# EAGLE design Tasmodul_WLED (EAGLE 9.6.2)
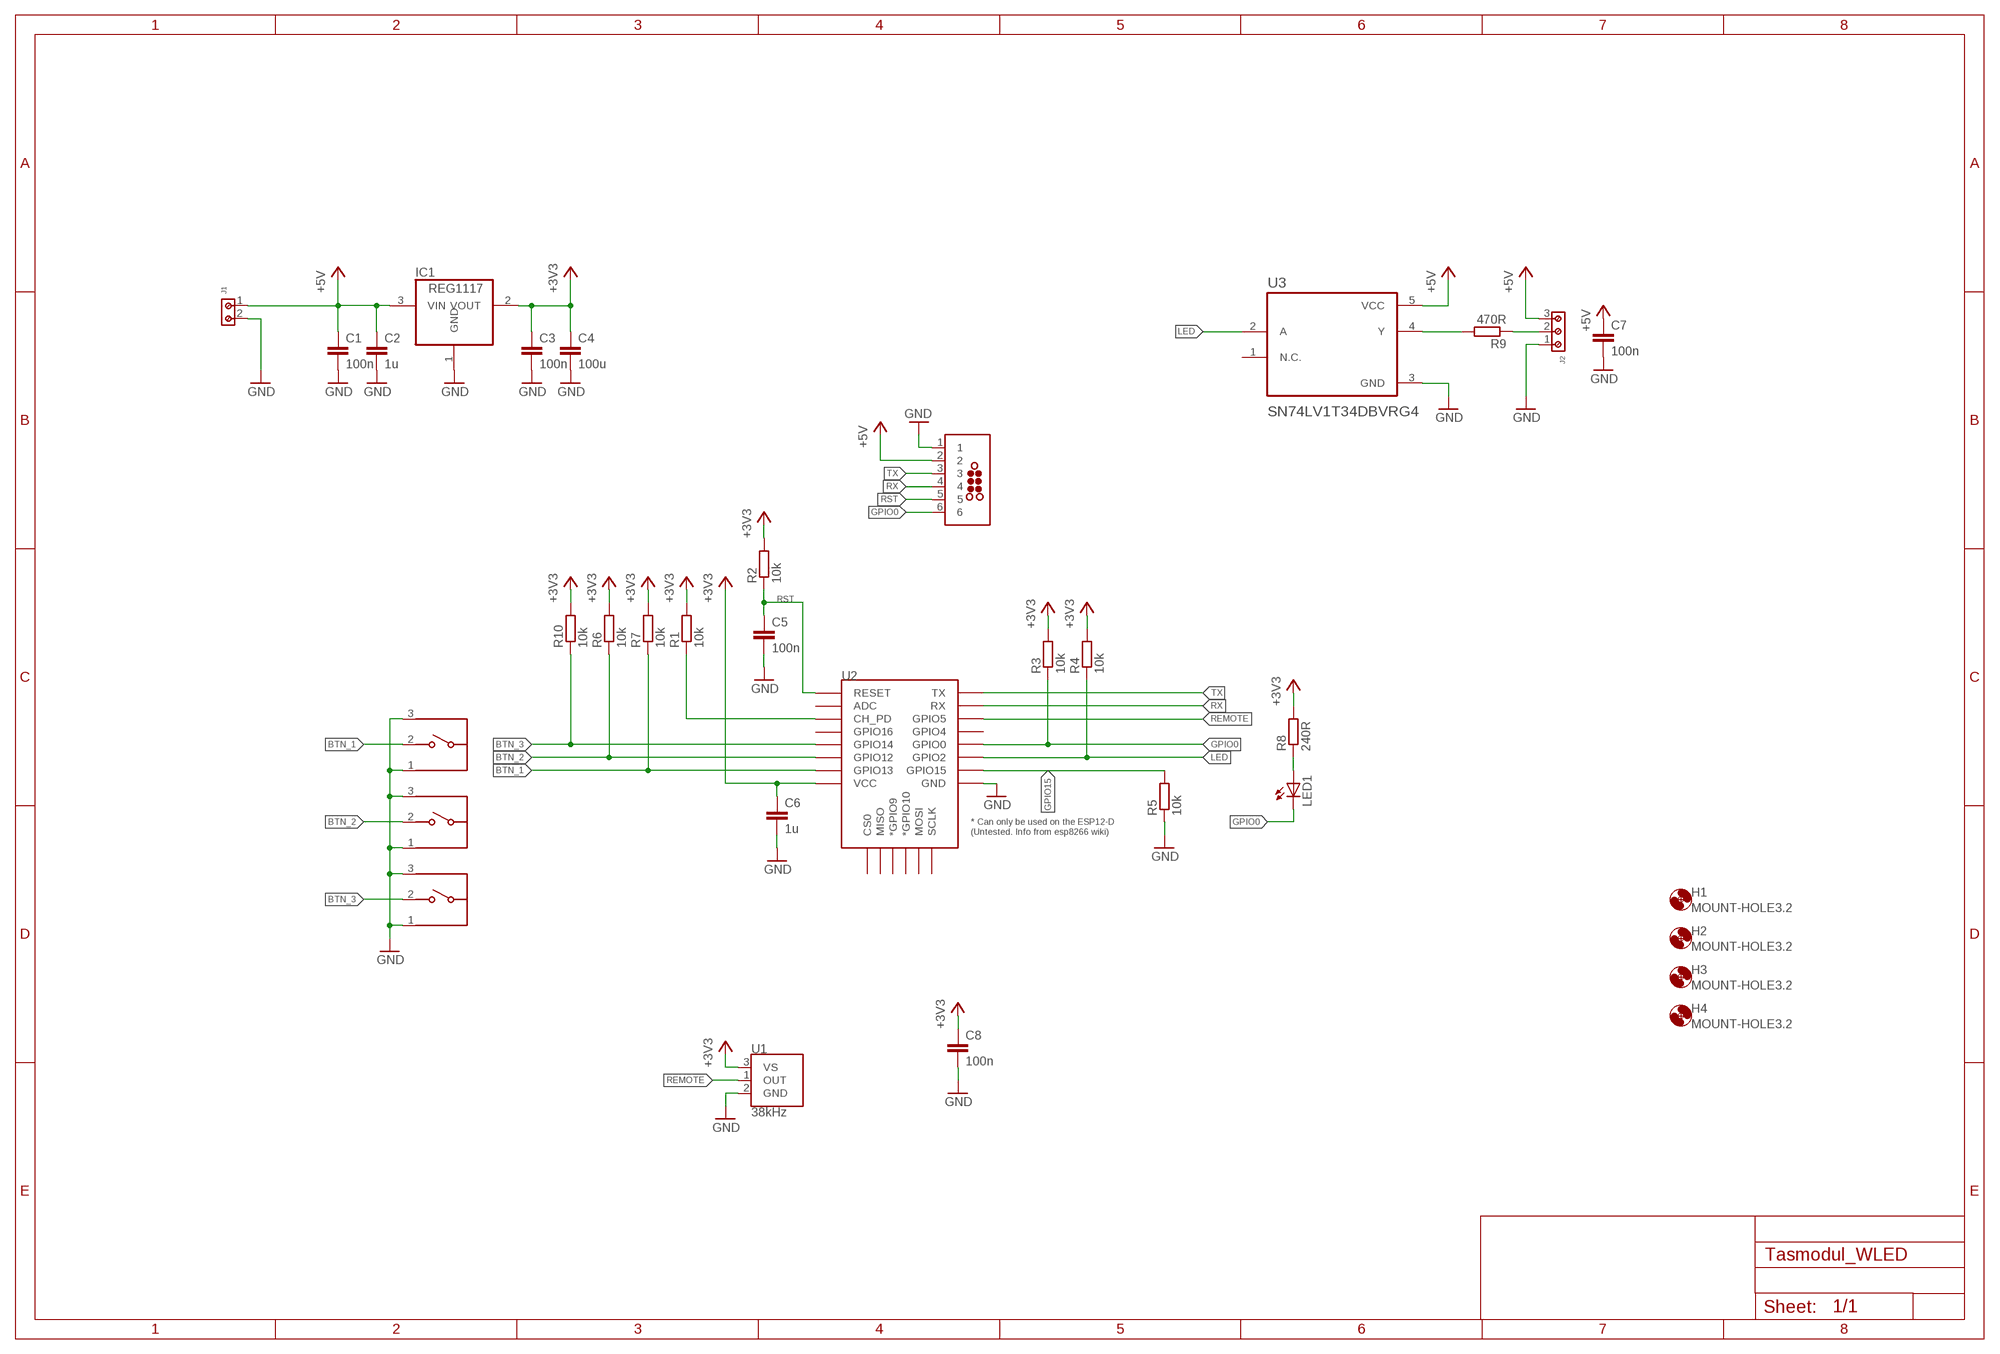
[diagram p0: schematic, sheet 1]

## Parts
C1  100n  C-EUC0603  [C0603]
C2  1u  C-EUC0603  [C0603]
C3  100n  C-EUC0603  [C0603]
C4  100u  C-EUC0603  [C0603]
C5  100n  C-EUC0603  [C0603]
C6  1u  C-EUC0603  [C0603]
C7  100n  C-EUC0603  [C0603]
C8  100n  C-EUC0603  [C0603]
H1  MOUNT-HOLE3.2  [3,2]
H2  MOUNT-HOLE3.2  [3,2]
H3  MOUNT-HOLE3.2  [3,2]
H4  MOUNT-HOLE3.2  [3,2]
IC1  REG1117  [SOT223]
J1  691210910002  [691210910002]
J2  691210910003  [691210910003]
J6  TC2030-MCP-NL  [TC2030-MCP-NL]
LED1  LEDCHIP-LED0603  [CHIP-LED0603]
R1  10k  R-EU_R0603  [R0603]
R2  10k  R-EU_R0603  [R0603]
R3  10k  R-EU_R0603  [R0603]
R4  10k  R-EU_R0603  [R0603]
R5  10k  R-EU_R0603  [R0603]
R6  10k  R-EU_R0603  [R0603]
R7  10k  R-EU_R0603  [R0603]
R8  240R  R-EU_R0603  [R0603]
R9  470R  R-EU_R0603  [R0603]
R10  10k  R-EU_R0603  [R0603]
S1  436333033816  [436333033816]
S2  436333033816  [436333033816]
S3  436333033816  [436333033816]
U1  38kHz  TSOP38238  [TSOP382]
U2  ESP12ESMD  [ESP12E-SMD]
U3  SN74LV1T34DBVRG4  [SOT95P280X145-5N]

## Nets
+3V3: C3.1 C4.1 C6.1 C8.1 IC1.2(VOUT) R1.2 R2.2 R3.2 R4.2 R6.2 R7.2 R8.2 R10.2 U1.3(VS) U2.VCC
+5V: C1.1 C2.1 C7.1 IC1.3(VIN) J1.1 J2.3 J6.2 U3.5(VCC)
BTN_1: R7.1 S3.2 U2.GPIO13
BTN_2: R6.1 S2.2 U2.GPIO12
BTN_3: R10.1 S1.2 U2.GPIO14
GND: C1.2 C2.2 C3.2 C4.2 C5.2 C6.2 C7.2 C8.2 IC1.1(GND) J1.2 J2.1 J6.1 R5.1 S1.1 S1.3 S2.1 S2.3 S3.1 S3.3 U1.2(GND) U2.GND U3.3(GND)
GPIO0: J6.6 LED1.C R3.1 U2.GPIO0
GPIO15: R5.2 U2.GPIO15
LED: R4.1 U2.GPIO2 U3.2(A)
N$1: LED1.A R8.1
N$2: R9.2 U3.4(Y)
N$3: J2.2 R9.1
N$5: R1.1 U2.CH_PD
REMOTE: U1.1(OUT) U2.GPIO5
RST: C5.1 J6.5 R2.1 U2.RESET
RX: J6.4 U2.RXD0(RX)
TX: J6.3 U2.TXD0(TX)
Unconnected: U2.ADC U2.CS0 U2.GPIO4 U2.GPIO9(*GPIO9) U2.GPIO10(*GPIO10) U2.GPIO16 U2.MISO U2.MOSI U2.SCLK U3.1(N.C.)

## Library data of the parts
C1-C8 = rcl:C-EU: CAPACITOR, European symbol
H1-H4 = holes:MOUNT-HOLE: MOUNTING HOLE with drill center marker
IC1 = burr-brown:REG1117: 800mA and 1A Low Dropout (LDO) Positive Regulator 1.8V, 2.5V, 2.85V, 3.3V, 5V, and Adj; MPN: REG1117; OC_FARNELL: 1097566; OC_NEWARK: 14P6981
J1 = Eagle_WR-TBL Rising Cage Clamp (rev20a):691210910002: WR-TBL Serie 2109 - 2.54 mm Horiz. Entry KIND PROPERTIES Pitch 2.54 mm MATERIAL PROPERTIES Insulator Material PA66 Insulator Flammability Rating UL94 V-0 Insulator Color Green Contact Material Brass Contact Plating Copper over Zinc Terminal Screw Material Steel Terminal Screw Plating Zinc Wire Guard Material Brass GENERAL INFORMATION Operating Temperature -40 up to +105 °C Compliance Lead free / RoHS ELECTRICAL PROPERTIES IR cULus 6 A Working Voltage [cULus] 150 V (AC) Withstanding Voltage [cULus] 1300 V (AC) Contact Resistance [cULus] 20 mΩ MECHANICAL PROPERTIES Wire Strip Length 4 up to 5 (mm) Screw M1.6 Solid Wire Section (AWG) 30 to 18 (AWG) Solid Wire Section (Metric) 0.0509 to 0.823 (mm²) Stranded Wire Section (AWG) 30 to 18 (AWG) Stranded Wire Section (Metric) 0.0509 to 0.823 (mm²) CERTIFICATION cULus Approval E315414 PACKAGING PROPERTIES Packaging Box <https://katalog.we-online.com/media/images/v2/o33231v209%20Family_WR-TBL_69121091000x.jpg> Details see: https://katalog.we-online.com/en/em/TBL_2_54_2109_HORIZONTAL_ENTRY_69121091000X Updated by Ella Wu 2019-11-12 2019(C) Wurth Elektronik; DATASHEET-URL: https://www.we-online.com/catalog/datasheet/691210910002.pdf; IR-UL: 6A; MOUNT: THT; PART-NUMBER: 691210910002; PINS: 2; PITCH: 2.54mm; TYPE: Horizontal; WIRE: 30 to 18 (AWG) 0.0509 to 0.823 (mm²); WORKING-VOLTAGE-UL: 150V (AC)
J2 = Eagle_WR-TBL Rising Cage Clamp (rev20a):691210910003: WR-TBL Serie 2109 - 2.54 mm Horiz. Entry KIND PROPERTIES Pitch 2.54 mm MATERIAL PROPERTIES Insulator Material PA66 Insulator Flammability Rating UL94 V-0 Insulator Color Green Contact Material Brass Contact Plating Copper over Zinc Terminal Screw Material Steel Terminal Screw Plating Zinc Wire Guard Material Brass GENERAL INFORMATION Operating Temperature -40 up to +105 °C Compliance Lead free / RoHS ELECTRICAL PROPERTIES IR cULus 6 A Working Voltage [cULus] 150 V (AC) Withstanding Voltage [cULus] 1300 V (AC) Contact Resistance [cULus] 20 mΩ MECHANICAL PROPERTIES Wire Strip Length 4 up to 5 (mm) Screw M1.6 Solid Wire Section (AWG) 30 to 18 (AWG) Solid Wire Section (Metric) 0.0509 to 0.823 (mm²) Stranded Wire Section (AWG) 30 to 18 (AWG) Stranded Wire Section (Metric) 0.0509 to 0.823 (mm²) CERTIFICATION cULus Approval E315414 PACKAGING PROPERTIES Packaging Box <https://katalog.we-online.com/media/images/v2/o33231v209%20Family_WR-TBL_69121091000x.jpg> Details see: https://katalog.we-online.com/en/em/TBL_2_54_2109_HORIZONTAL_ENTRY_69121091000X Updated by Ella Wu 2019-11-12 2019(C) Wurth Elektronik; DATASHEET-URL: https://www.we-online.com/catalog/datasheet/691210910003.pdf; IR-UL: 6A; MOUNT: THT; PART-NUMBER: 691210910003; PINS: 3; PITCH: 2.54mm; TYPE: Horizontal; WIRE: 30 to 18 (AWG) 0.0509 to 0.823 (mm²); WORKING-VOLTAGE-UL: 150V (AC)
J6 = tag-connect:TC2030: TAG-CONNECT ICSP Connector Manufacturer: Tag-Connect <http://www.tag-connect.com> Cable for easy In-Circuit Serial Programming. Designed for Microchip ICD2, suitable for many others. Two variants - one "with legs" (for hands-free fit on PCB) and another "without legs" for quick programming. PAD Description 1 MCLR/Vpp 2 Vdd 3 GND 4 PGD (ISPDAT) 5 PGC (ISPCLK) 6 nc (used for LVP) ©2009 ROFA.cz - modified and updated by Robert Darlington ‹rdarlington@gmail.com›
LED1 = led:LED: LED OSRAM: - CHIPLED LG R971, LG N971, LY N971, LG Q971, LY Q971, LO R971, LY R971 LH N974, LH R974 LS Q976, LO Q976, LY Q976 LO Q996 - Hyper CHIPLED LW Q18S LB Q993, LB Q99A, LB R99A - SideLED LS A670, LO A670, LY A670, LG A670, LP A670 LB A673, LV A673, LT A673, LW A673 LH A674 LY A675 LS A676, LA A676, LO A676, LY A676, LW A676 LS A679, LY A679, LG A679 - Hyper Micro SIDELED® LS Y876, LA Y876, LO Y876, LY Y876 LT Y87S - SmartLED LW L88C, LW L88S LB L89C, LB L89S, LG L890 LS L89K, LO L89K, LY L89K LS L896, LA L896, LO L896, LY L896 - TOPLED LS T670, LO T670, LY T670, LG T670, LP T670 LSG T670, LSP T670, LSY T670, LOP T670, LYG T670 LG T671, LOG T671, LSG T671 LB T673, LV T673, LT T673, LW T673 LH T674 LS T676, LA T676, LO T676, LY T676, LB T676, LH T676, LSB T676, LW T676 LB T67C, LV T67C, LT T67C, LS T67K, LO T67K, LY T67K, LW E67C LS E67B, LA E67B, LO E67B, LY E67B, LB E67C, LV E67C, LT E67C LW T67C LS T679, LY T679, LG T679 LS T770, LO T770, LY T770, LG T770, LP T770 LB T773, LV T773, LT T773, LW T773 LH T774 LS E675, LA E675, LY E675, LS T675 LS T776, LA T776, LO T776, LY T776, LB T776 LHGB T686 LT T68C, LB T68C - Hyper Mini TOPLED® LB M676 - Mini TOPLED Santana® LG M470 LS M47K, LO M47K, LY M47K Source: http://www.osram.convergy.de LUXEON: - LUMILED® LXK2-PW12-R00, LXK2-PW12-S00, LXK2-PW14-U00, LXK2-PW14-V00 LXK2-PM12-R00, LXK2-PM12-S00, LXK2-PM14-U00 LXK2-PE12-Q00, LXK2-PE12-R00, LXK2-PE12-S00, LXK2-PE14-T00, LXK2-PE14-U00 LXK2-PB12-K00, LXK2-PB12-L00, LXK2-PB12-M00, LXK2-PB14-N00, LXK2-PB14-P00, LXK2-PB14-Q00 LXK2-PR12-L00, LXK2-PR12-M00, LXK2-PR14-Q00, LXK2-PR14-R00 LXK2-PD12-Q00, LXK2-PD12-R00, LXK2-PD12-S00 LXK2-PH12-R00, LXK2-PH12-S00 LXK2-PL12-P00, LXK2-PL12-Q00, LXK2-PL12-R00 Source: www.luxeon.com KINGBRIGHT: KA-3528ASYC Source: www.kingbright.com
R1-R10 = rcl:R-EU_: RESISTOR, European symbol
S1-S3 = Wurth_Switch_WS-TASU:436333033816: WS-TASU J-Bend SMT Tact Switch with Boss Design 4.5 x 3.4mm side push MATERIAL PROPERTIES Cover Material Copper Alloy PROPERTIES Actuator Material HTN Actuator Flammability Rating UL94 V-0 Actuator Color Black Frame Material HTN Frame Flammability Rating UL94 V-0 Frame Color Black Contact Material Stainless Steel Contact Plating Silver Terminal Material Copper Alloy Terminal Plating Silver VR 12 V (DC) Contact Resistance Initial 500 mΩ Contact Resistance After Life Test 2 Ω RISO 100 MΩ Withstanding Voltage 250 V (AC) Washable No Mechanical Properties Electrical Life 100000 Cycles Stroke (Value) 0.2 mm GENERAL INFORMATION Operating Temperature -40 up to +85 °C Washable No PACKAGING PROPERTIES Packaging Tape and Reel <https://www.we-online.de/katalog/media/o64618v209%20Family_WS-TASU_J-Bend_SMD_Tact_Switch_with_boss_design_436353045816.jpg> Details see: https://www.we-online.de/katalog/en/WS-TASU_J-BEND_SMT_TACT_SWITCH_SIDE_PUSH Updated by Ella Wu 2021-01-25 2021(C) Wurth Elektronik; DATASHEET-URL: https://www.we-online.com/catalog/datasheet/436333033816.pdf; H: 3.3mm; OPERATION-FORCE: 160g; PART-NUMBER: 436333033816
U1 = SparkFun-Sensors:TSOP382: Vishay Semiconductor TSOP32838 - 38kHz IR Receiver These products are miniaturized IR receiver modules for infrared remote control systems. A PIN diode and a preamplifier are assembled on a leadframe, the epoxy package contains an IR filter. The demodulated output signal can be directly connected to a microprocessor for decoding.; PROD_ID: SEN-10266
U2 = esp8266modules:ESP12E: ESP12E Module
U3 = SN74LV1T34DBVRG4:SN74LV1T34DBVRG4: Check availability <https://pricing.snapeda.com/parts/SN74LV1T34DBVRG4/Texas%20Instruments/view-part?ref=eda>; AVAILABILITY: In Stock; DESCRIPTION: Single Power Supply BUFFER Logic Level Shifter (no enable); MF: Texas Instruments; MP: SN74LV1T34DBVRG4; PACKAGE: SOT-23-5 Texas Instruments; PRICE: None; PURCHASE-URL: https://pricing.snapeda.com/search/part/SN74LV1T34DBVRG4/?ref=eda

## Board
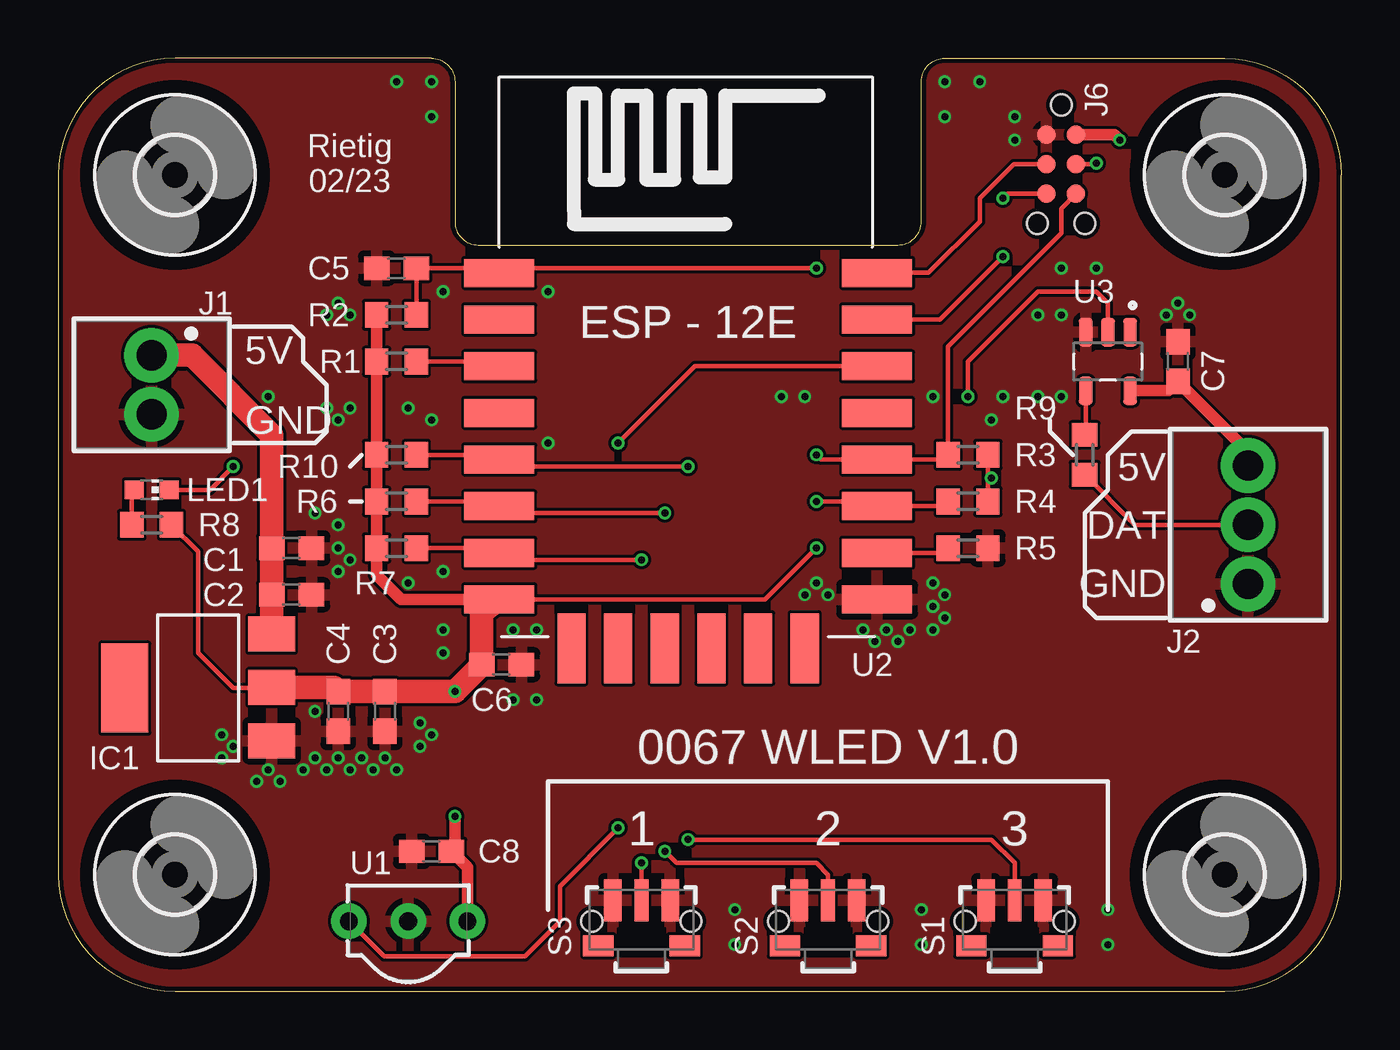
[diagram p1: board, top side]
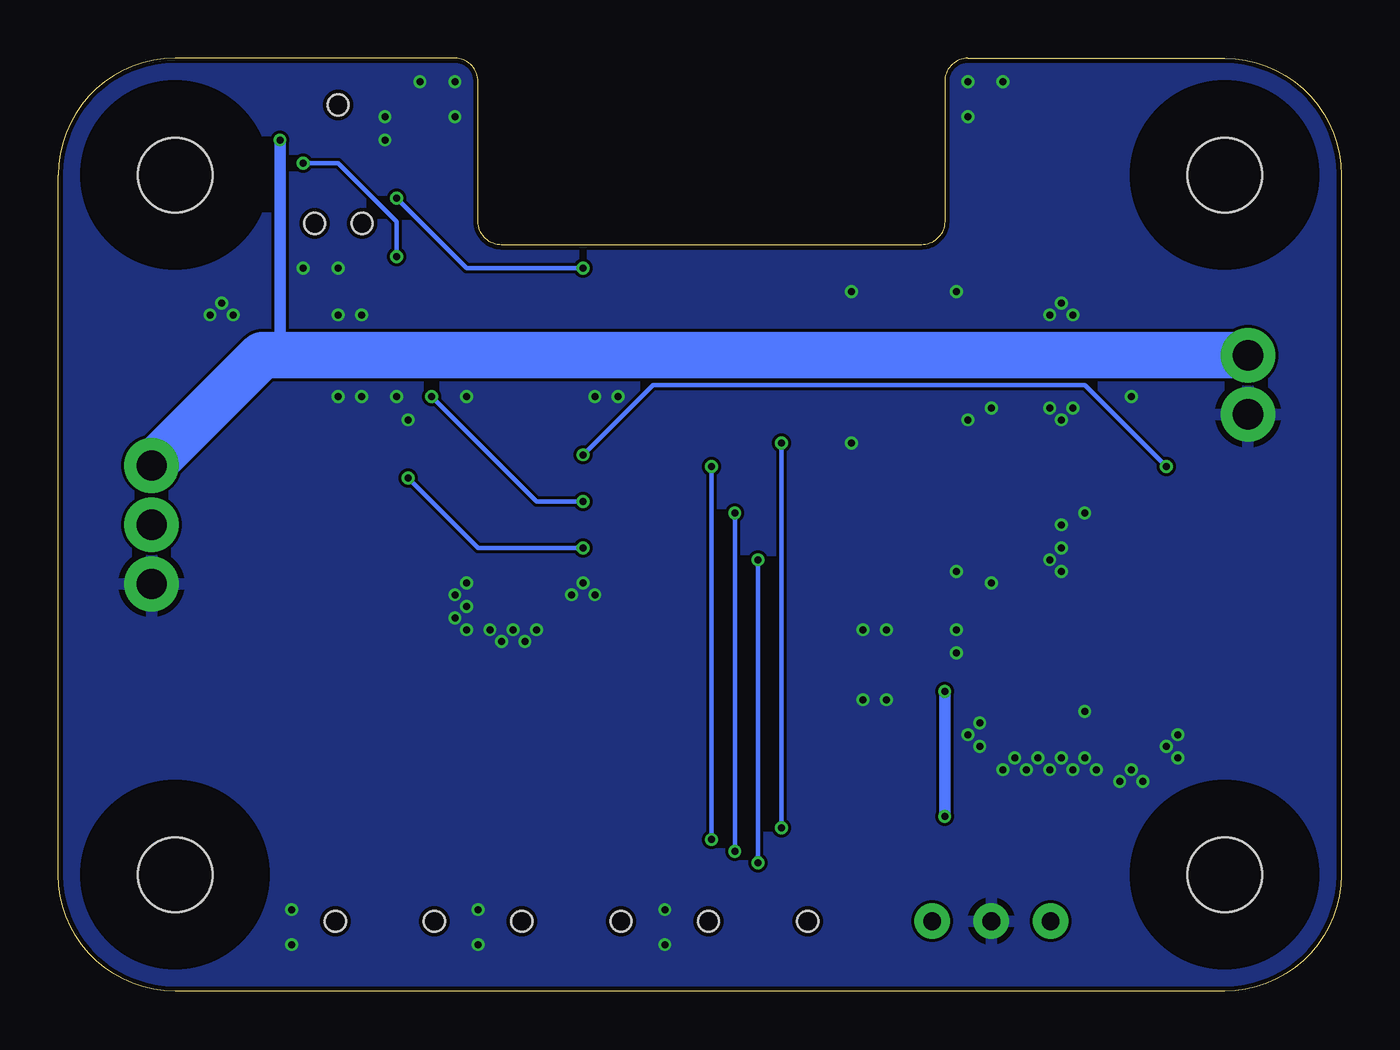
[diagram p2: board, bottom side, seen from below]

Size 55 x 40 mm. Coordinates in mm from the lower left corner, seen from the top.
Outline: 38,40 50,40 arc-90 55,35 55,5 arc-90 50,0 5,0 arc-90 0,5 0,35 arc-90 5,40 16,40 arc-90 17,39 17,33 arc90 18,32 36,32 arc90 37,33 37,39 arc-90 38,40
Copper layers (1*16): Top 0.035mm / dielectric 1.6mm / Bottom 0.035mm
Design rules "jlcpcb-2layers *": minimum track width 0.2mm, minimum drill 0.3mm, track to track 5mil, track to pad 5mil, pad to pad 5mil, via to via 5mil, smd to smd 5mil, copper to edge 0.2mm, drill to drill 6mil, minimum pad ring 10mil, minimum via ring 0.125mm, stop-mask expansion 4mil, vias tented up to drill 0.3mm, thermal gap 10mil

### Footprints (pad centres in the part's own frame; a part is rotated, then mirrored left to right if it is on the bottom)
C0603 = smd 1.1 x 1: 1 -0.85,0; 2 0.85,0
3,2 = hole 3.2: 0,0
SOT223 = smd 1.499 x 2.007: 1 -2.261,-3.15; 2 0.025,-3.15; 3 2.311,-3.15 | smd 3.81 x 2.007: 4 0,3.15
691210910002 = drill 1.3: 1 -1.27,0; 2 1.27,0
691210910003 = drill 1.3: 1 -2.54,0; 2 0,0; 3 2.54,0
TC2030-MCP-NL = smd 0.787 x 0.787: 1 1.27,-0.635; 2 1.27,0.635; 3 2.54,-0.635; 4 2.54,0.635; 5 3.81,-0.635; 6 3.81,0.635 | hole 0.889: 0,0; 5.08,-1.016; 5.08,1.016
CHIP-LED0603 = smd 0.8 x 0.8: A 0,-0.75; C 0,0.75
R0603 = smd 1 x 1.1: 1 -0.85,0; 2 0.85,0
436333033816 = smd 0.75 x 1.8: 1 -1.225,0.9; 3 1.225,0.9 | smd 0.6 x 1.8: 2 0,0.9 | smd 1.3 x 0.9: Z1 -1.85,-1.05; Z2 1.85,-1.05 | hole 0.9: -2.125,0; 2.125,0
TSOP382 = drill 0.762 pad 1.524: 1 -2.54,0; 2 0,0; 3 2.54,0
ESP12E-SMD = smd 3 x 1.2: ADC -8.1,3.8; CH_PD -8.1,1.8; GND 8.1,-8.2; GPIO0 8.1,-2.2; GPIO2 8.1,-4.2; GPIO4 8.1,-0.2; GPIO5 8.1,1.8; GPIO12 -8.1,-4.2; GPIO13 -8.1,-6.2; GPIO14 -8.1,-2.2; GPIO15 8.1,-6.2; GPIO16 -8.1,-0.2; RESET -8.1,5.8; RXD0 8.1,3.8; TXD0 8.1,5.8; VCC -8.1,-8.2 | smd 1.2 x 3: CS0 -5,-10.3; GPIO9 -1,-10.3; GPIO10 1,-10.3; MISO -3,-10.3; MOSI 3,-10.3; SCLK 5,-10.3
SOT95P280X145-5N = smd 1.21 x 0.59: 1 -1.255,0.95; 2 -1.255,0; 3 -1.255,-0.95; 4 1.255,-0.95; 5 1.255,0.95

### Placement (x,y rotation side)
C1  10,19 0 top
C2  10,17 0 top
C3  14,12 270 top
C4  12,12 270 top
C5  14.5,31 180 top
C6  19,14 0 top
C7  48,27 90 top
C8  16,6 180 top
H1  50,5 0 top
H2  5,35 0 top
H3  5,5 0 top
H4  50,35 0 top
IC1  6,13 90 top
J1  4,26 270 top
J2  51,20 90 top
J6  43,38 270 top
LED1  4,21.5 270 top
R1  14.5,27 180 top
R2  14.5,29 180 top
R3  39,23 0 top
R4  39,21 0 top
R5  39,19 180 top
R6  14.5,21 180 top
R7  14.5,19 180 top
R8  4,20 0 top
R9  44,23 90 top
R10  14.5,23 180 top
S1  41,3 0 top
S2  33,3 0 top
S3  25,3 0 top
U1  15,3 0 top
U2  27,25 0 top
U3  45,27 270 top

### Tracks (layer width: path | path; a pad name or v marks a point on that pad's centre or on a via)
+3V3  (via drill 0.3)
  Top 0.2: U2.VCC 30.3,16.8 v32.5,19 | R3.2 39.85,22.15 v40,22 39.85,21.85 R4.2 | R8.2 6,18.85 6,14.5 7.5,13 9.12,13 IC1.2
  Top 0.5: R2.2 R1.2 R10.2 R6.2 R7.2 13.65,17.85 14.7,16.8 U2.VCC | U1.3 17.54,5.31 C8.1 17,6.15 v17,7.5
  Top 1: IC1.2 11.82,13.03 C4.1 C3.1 v17,12.85 C6.1 18.15,16.25 U2.VCC
  Bottom 0.2: v32.5,19 37,19 v40,22
  Bottom 0.5: v17,7.5 v17,12.85
+5V  (via drill 0.3)
  Top 0.5: U3.5 47.59,25.75 C7.1 51,23.15 J2.3 | J6.2 45.27,36.73 v45.5,36.5
  Top 1: J1.1 5.73,27.27 9.15,23.85 C1.1 C2.1 IC1.3
  Bottom 0.5: 46.27,27.27 45.65,27.89 45.5,28.04 v45.5,36.5
  Bottom 2: J1.1 46.27,27.27 J2.3
BTN_1  (via drill 0.3)
  Top 0.2: S3.2 v25,5.5 | v25,18.5 19,18.5 U2.GPIO13 18.5,19 R7.1
  Bottom 0.2: v25,5.5 v25,18.5
BTN_2  (via drill 0.3)
  Top 0.2: v26,20.5 19,20.5 U2.GPIO12 18.5,21 R6.1 | S2.2 33,5 32.5,5.5 26.5,5.5 v26,6
  Bottom 0.2: v26,6 v26,20.5
BTN_3  (via drill 0.3)
  Top 0.2: S1.2 41,5.5 40,6.5 v27,6.5 | v27,22.5 19,22.5 U2.GPIO14 18.5,23 R10.1
  Bottom 0.2: v27,6.5 v27,22.5
GND  (via drill 0.3)
  other vias: 29,2 37,2 45,2 7,11 7.5,10.5 7,10 11,12 11,10 11.5,9.5 12,10 12.5,9.5 13,10 13.5,9.5 14,10 14.5,9.5 8.5,9 9,9.5 9.5,9 10.5,9.5 12,19 12,18 12.5,18.5 11,20.5 12,20 34.5,15.5 35,15 35.5,15.5 36,15 36.5,15.5 37.5,16.5 38,17 37.5,17.5 38,16 37.5,15.5 16,39 14.5,39 16,37.5 38,39 38,37.5 39.5,39 29,3.5 37,3.5 45,3.5 33,17 32,17 32.5,17.5 19.5,12.5 20.5,12.5 19.5,15.5 20.5,15.5 15.5,11.5 15.5,10.5 16,11 16,24.5 21,23.5 21,30 16.5,30 43,29 42,29 47.5,29 48,29.5 48.5,29 41,37.5 41,36.5 16.5,15.5 16.5,14.5 15,17.5 16.5,18 9,25.5 11.5,25 12.5,25 12.5,29 11.5,29 12,24.5 12,29.5 42,25.5 43,25.5 40.5,25.5 43,31 44.5,31 15,25 31,25.5 32,25.5 37.5,25.5 40,24.5
  pour Bottom: 0,40 55,40 55,0 0,0
  pour Top: 0,40 55,40 55,0 0,0
GPIO0  (via drill 0.3)
  Top 0.2: J6.6 43,33.55 43,32.5 38.15,27.65 R3.1 37.95,22.8 U2.GPIO0 32.7,22.8 v32.5,23 | LED1.C 6.5,21.5 v7.5,22.5
  Bottom 0.2: v7.5,22.5 11,26 29.5,26 v32.5,23
GPIO15
  Top 0.2: U2.GPIO15 37.95,18.8 R5.2
LED  (via drill 0.3)
  Top 0.2: R4.1 37.95,20.8 U2.GPIO2 34.9,21 v32.5,21 | U3.2 45,29.5 44.5,30 42,30 39,27 v39,25.5
  Bottom 0.2: v39,25.5 34.5,21 v32.5,21
N$1
  Top 0.2: R8.1 3.15,21.4 LED1.A
N$2
  Top 0.2: U3.4 44.05,23.9 R9.2
N$3
  Top 0.2: J2.2 46.15,20 R9.1
N$5
  Top 0.2: R1.1 18.5,27 U2.CH_PD
REMOTE  (via drill 0.3)
  Top 0.2: U1.1 13.96,1.5 20,1.5 21.5,3 21.5,4.5 v24,7 | v24,23.5 27.3,26.8 U2.GPIO5
  Bottom 0.2: v24,7 v24,23.5
RST  (via drill 0.3)
  Top 0.2: R2.1 C5.1 18.5,31 U2.RESET 18.9,31 v32.5,31 | v40.5,34 40.69,34.19 J6.5
  Bottom 0.2: v32.5,31 37.5,31 v40.5,34
RX  (via drill 0.3)
  Top 0.2: U2.RXD0 37.8,28.8 v40.5,31.5 | v44.5,35.5 44.46,35.46 J6.4
  Bottom 0.2: v40.5,31.5 40.5,33 43,35.5 v44.5,35.5
TX
  Top 0.2: U2.TXD0 37.3,30.8 39.5,33 39.5,34 40.96,35.46 J6.3

### Text on the board
tNames: Rietig / 02/23 | 5V | GND | 5V | DAT | GND | 0067 WLED V1.0 | 1 | 2 | 3